# EAGLE schematic swimate_display (EAGLE 6.4)
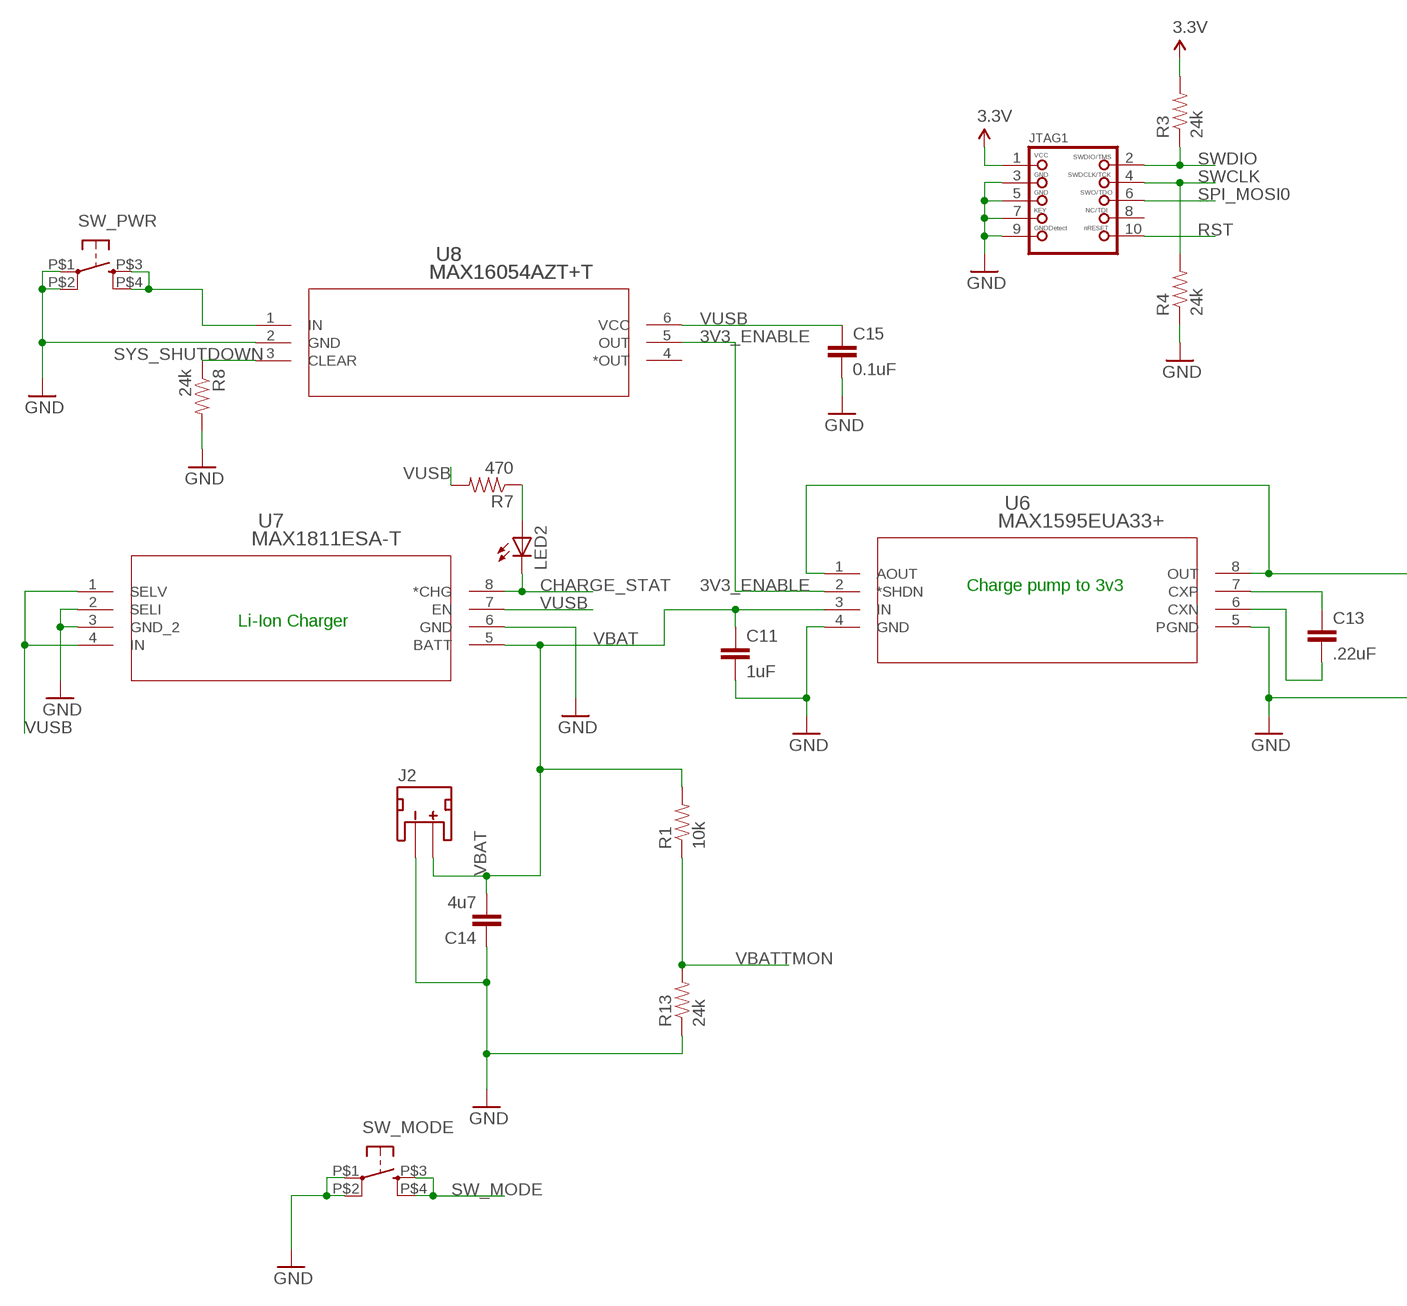
[diagram p0: schematic, sheet 1, part 1 of 2]
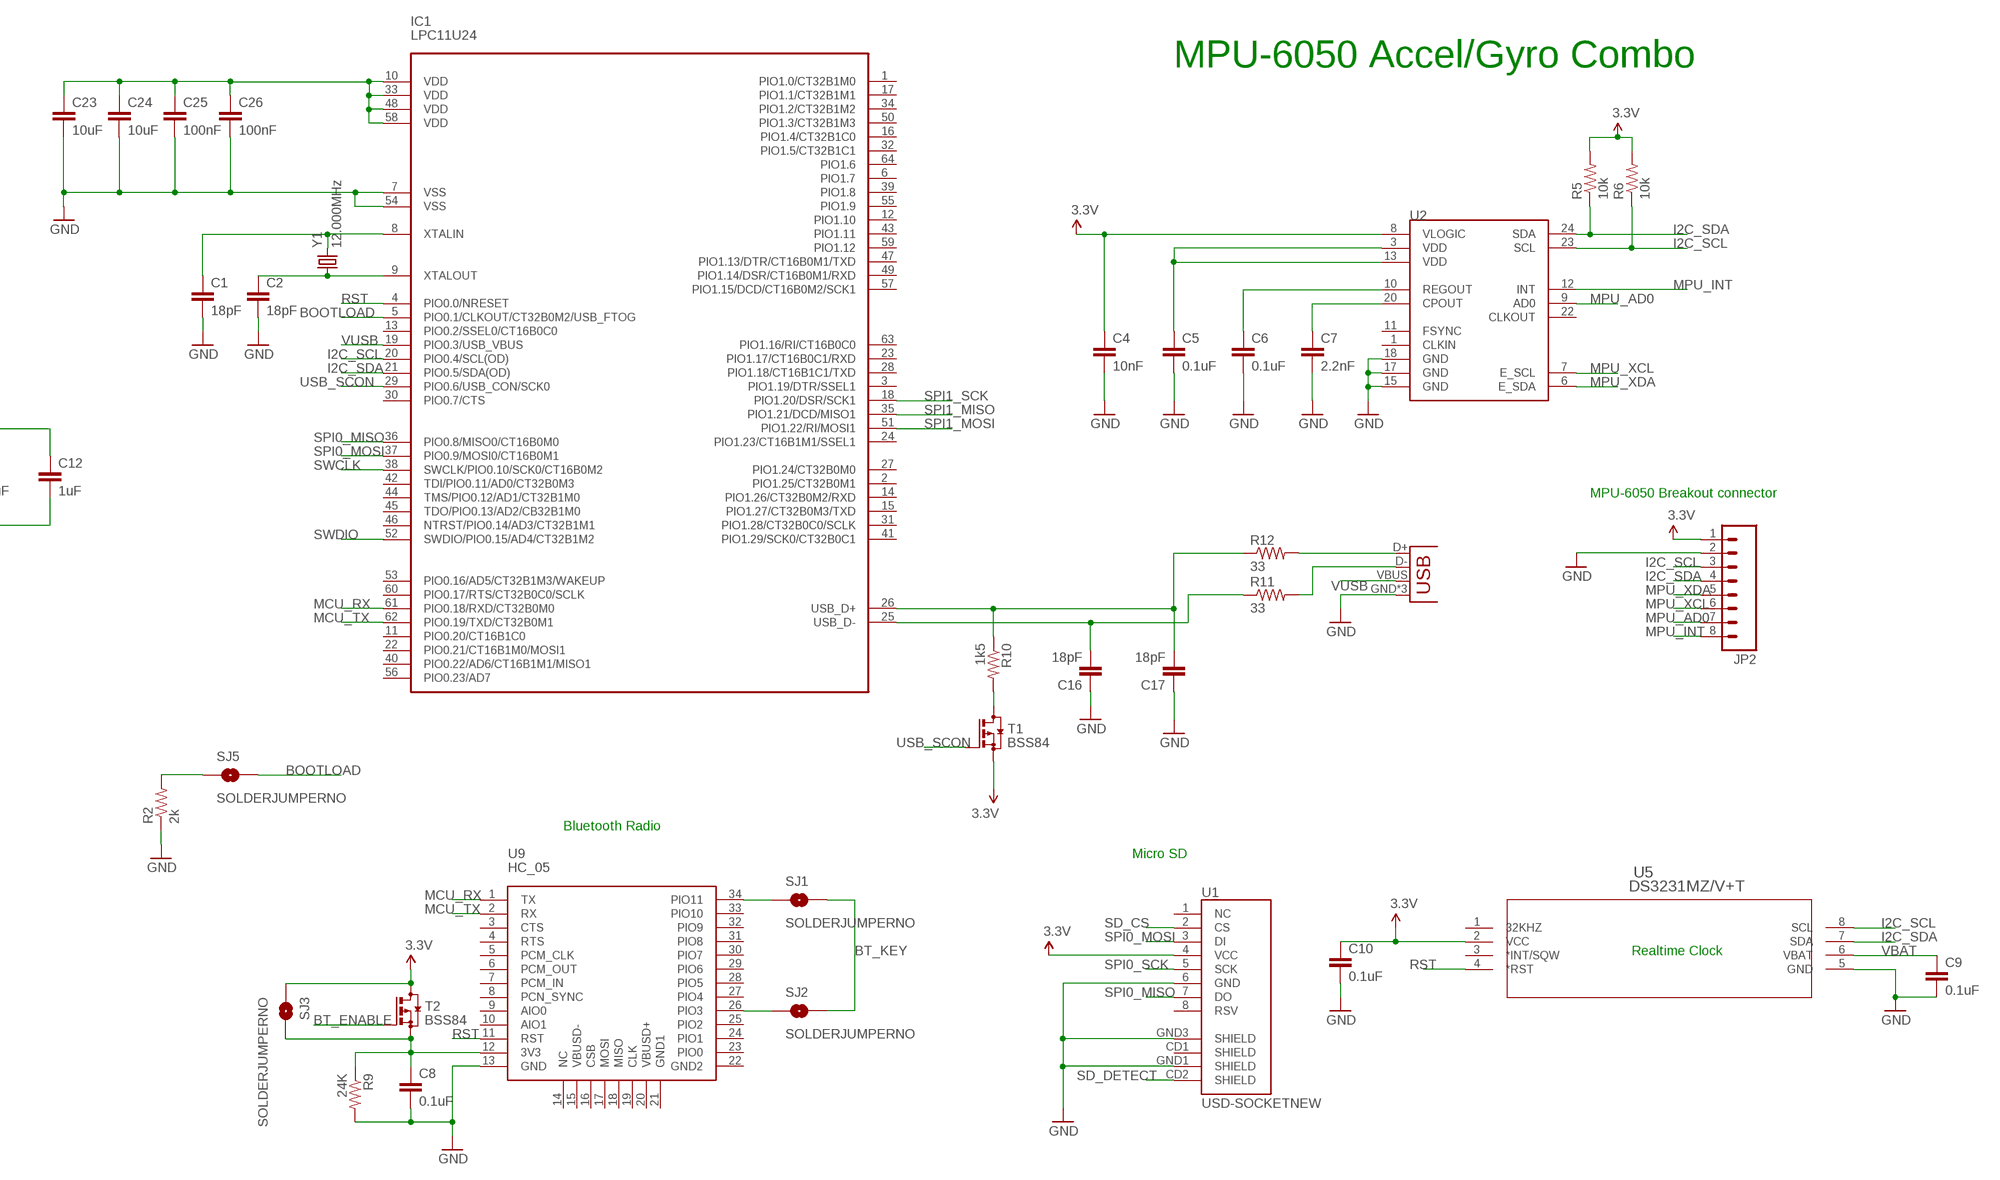
[diagram p1: schematic, sheet 1, part 2 of 2]

## Parts
C1  18pF  CAP0805  [0805]
C2  18pF  CAP0805  [0805]
C4  10nF  CAP0805  [0805]
C5  0.1uF  CAP0805  [0805]
C6  0.1uF  CAP0805  [0805]
C7  2.2nF  CAP0805  [0805]
C8  0.1uF  CAP0805  [0805]
C9  0.1uF  CAP0805  [0805]
C10  0.1uF  CAP0805  [0805]
C11  1uF  CAP1206  [1206]
C12  1uF  CAP1206  [1206]
C13  .22uF  CAP0805  [0805]
C14  4u7  CAP1206  [1206]
C15  0.1uF  CAP0805  [0805]
C16  18pF  CAP0805  [0805]
C17  18pF  CAP0805  [0805]
C23  10uF  CAP0805  [0805]
C24  10uF  CAP0805  [0805]
C25  100nF  CAP0805  [0805]
C26  100nF  CAP0805  [0805]
IC1  LPC11U24  [MBED-ICS_LQFP64]
J2  JST_2MM_MALE  [JST-2-SMD]
JP2  M08  [1X08_PIN1_NO_SILK]
JP3  USB-MICROB  [USB-MICROB]
JTAG1  JTAG-CORTEXM3  [2X05_1.27MM_SMT]
LED2  LED1206  [LED-1206]
R1  10k  RESISTOR0603-RES  [0603-RES]
R2  2k  RESISTOR0805-RES  [0805]
R3  24k  RESISTOR0805-RES  [0805]
R4  24k  RESISTOR0805-RES  [0805]
R5  10k  RESISTOR0805-RES  [0805]
R6  10k  RESISTOR0805-RES  [0805]
R7  470  RESISTOR0805-RES  [0805]
R8  24k  RESISTOR0805-RES  [0805]
R9  24K  RESISTOR0805-RES  [0805]
R10  1k5  RESISTOR0805-RES  [0805]
R11  33  RESISTOR0805-RES  [0805]
R12  33  RESISTOR0805-RES  [0805]
R13  24k  RESISTOR0603-RES  [0603-RES]
SJ1  SOLDERJUMPERNO  [SJ_2S-NO]
SJ2  SOLDERJUMPERNO  [SJ_2S-NO]
SJ3  SOLDERJUMPERNO  [SJ_2S-NO]
SJ5  SOLDERJUMPERNO  [SJ_2S-NO]
SW_MODE  TAC_SWITCHKSA_SEALED  [KSA_SEALED_TAC_SWITCH]
SW_PWR  TAC_SWITCHKSA_SEALED  [KSA_SEALED_TAC_SWITCH]
T1  BSS84  [SOT23]
T2  BSS84  [SOT23]
U1  USD-SOCKETNEW  [MICRO-SD-SOCKET-PP]
U2  MPU-9150QFN-24-NP  [QFN-24-NP]
U5  DS3231MZ/V+T  [21-0041B_8]
U6  MAX1595EUA33+  [21-0036K]
U7  MAX1811ESA-T  [21-0041B_8]
U8  MAX16054AZT+T  [21-0114C]
U9  HC_05  [BLUETOOTH_SMD]
Y1  12.000MHz  CRYSTAL10.5X4.8  [CRYSTAL-SMD-10.5X4.8-2PIN]

## Nets
3.3V: C4.1 C10.1 JP2.1 JTAG1.1 R3.2 R5.2 R6.2 SJ3.1 T1.2(S) T2.3(D) U1.4(VCC) U2.8(VLOGIC) U5.2(VCC)
3V3_ENABLE: U6.2(*SHDN) U8.5(OUT)
BOOTLOAD: IC1.5(PIO0.1/CLKOUT/CT32B0M2/USB_FTOG) SJ5.2
BT_ENABLE: T2.1(G)
BT_KEY: SJ1.2 SJ2.2
CHARGE_STAT: LED2.C U7.8(*CHG)
GND: C1.2 C2.2 C4.2 C5.2 C6.2 C7.2 C8.2 C9.2 C10.2 C11.2 C12.2 C14.1 C15.2 C16.1 C17.1 C23.2 C24.2 C25.2 C26.2 IC1.7(VSS) IC1.54(VSS) J2.1(-) JP2.2 JP3.GND JP3.MT1(GND) JP3.MT2(GND) JTAG1.3 JTAG1.5 JTAG1.7 JTAG1.9 R2.1 R4.1 R8.2 R9.2 R13.1 SW_MODE.P$1 SW_MODE.P$2 SW_PWR.P$1 SW_PWR.P$2 U1.6(GND) U1.GND1(SHIELD) U1.GND3(SHIELD) U2.15(GND) U2.17(GND) U2.18(GND) U5.5(GND) U6.4(GND) U6.5(PGND) U7.2(SELI) U7.3(GND_2) U7.6(GND) U8.2(GND) U9.13(GND)
I2C_SCL: IC1.20(PIO0.4/SCL(OD)) JP2.3 R6.1 U2.23(SCL) U5.8(SCL)
I2C_SDA: IC1.21(PIO0.5/SDA(OD)) JP2.4 R5.1 U2.24(SDA) U5.7(SDA)
MCU_RX: IC1.61(PIO0.18/RXD/CT32B0M0) U9.1(TX)
MCU_TX: IC1.62(PIO0.19/TXD/CT32B0M1) U9.2(RX)
MPU_AD0: JP2.7 U2.9(AD0)
MPU_INT: JP2.8 U2.12(INT)
MPU_XCL: JP2.6 U2.7(E_SCL)
MPU_XDA: JP2.5 U2.6(E_SDA)
N$1: SW_PWR.P$3 SW_PWR.P$4 U8.1(IN)
N$4: C5.1 U2.3(VDD) U2.13(VDD)
N$5: C6.1 U2.10(REGOUT)
N$6: C23.1 C24.1 C25.1 C26.1 IC1.10(VDD) IC1.33(VDD) IC1.48(VDD) IC1.58(VDD)
N$7: C7.1 U2.20(CPOUT)
N$8: LED2.A R7.1
N$9: SJ2.1 U9.26(PIO3)
N$11: SJ1.1 U9.34(PIO11)
N$12: C12.1 U6.1(AOUT) U6.8(OUT)
N$13: C13.1 U6.7(CXP)
N$14: C13.2 U6.6(CXN)
N$15: C8.1 R9.1 SJ3.2 T2.2(S) U9.12(3V3)
N$16: R10.2 T1.3(D)
N$17: C17.2 IC1.26(USB_D+) R10.1 R12.1
N$18: C16.2 IC1.25(USB_D-) R11.1
N$19: JP3.D+ R12.2
N$20: JP3.D- R11.2
N$21: R2.2 SJ5.1
N$23: C1.1 IC1.8(XTALIN) Y1.P$2
N$24: C2.1 IC1.9(XTALOUT) Y1.P$1
RST: IC1.4(PIO0.0/NRESET) JTAG1.10 U5.4(*RST) U9.11(RST)
SD_CS: U1.2(CS)
SD_DETECT: U1.CD2(SHIELD)
SPI0_MISO: IC1.36(PIO0.8/MISO0/CT16B0M0) U1.7(DO)
SPI0_MOSI: IC1.37(PIO0.9/MOSI0/CT16B0M1) U1.3(DI)
SPI0_SCK: U1.5(SCK)
SPI1_MISO: IC1.35(PIO1.21/DCD/MISO1)
SPI1_MOSI: IC1.51(PIO1.22/RI/MOSI1)
SPI1_SCK: IC1.18(PIO1.20/DSR/SCK1)
SPI_MOSI0: JTAG1.6
SW_MODE: SW_MODE.P$3 SW_MODE.P$4
SWCLK: IC1.38(SWCLK/PIO0.10/SCK0/CT16B0M2) JTAG1.4 R4.2
SWDIO: IC1.52(SWDIO/PIO0.15/AD4/CT32B1M2) JTAG1.2 R3.1
SYS_SHUTDOWN: R8.1 U8.3(CLEAR)
USB_SCON: IC1.29(PIO0.6/USB_CON/SCK0) T1.1(G)
VBAT: C9.1 C11.1 C14.2 J2.2(+) R1.2 U5.6(VBAT) U6.3(IN) U7.5(BATT)
VBATTMON: R1.1 R13.2
VUSB: C15.1 IC1.19(PIO0.3/USB_VBUS) JP3.VBUS R7.2 U7.1(SELV) U7.4(IN) U7.7(EN) U8.6(VCC)
Unconnected: IC1.1(PIO1.0/CT32B1M0) IC1.2(PIO1.25/CT32B0M1) IC1.3(PIO1.19/DTR/SSEL1) IC1.6(PIO1.7) IC1.11(PIO0.20/CT16B1C0) IC1.12(PIO1.10) IC1.13(PIO0.2/SSEL0/CT16B0C0) IC1.14(PIO1.26/CT32B0M2/RXD) IC1.15(PIO1.27/CT32B0M3/TXD) IC1.16(PIO1.4/CT32B1C0) IC1.17(PIO1.1/CT32B1M1) IC1.22(PIO0.21/CT16B1M0/MOSI1) IC1.23(PIO1.17/CT16B0C1/RXD) IC1.24(PIO1.23/CT16B1M1/SSEL1) IC1.27(PIO1.24/CT32B0M0) IC1.28(PIO1.18/CT16B1C1/TXD) IC1.30(PIO0.7/CTS) IC1.31(PIO1.28/CT32B0C0/SCLK) IC1.32(PIO1.5/CT32B1C1) IC1.34(PIO1.2/CT32B1M2) IC1.39(PIO1.8) IC1.40(PIO0.22/AD6/CT16B1M1/MISO1) IC1.41(PIO1.29/SCK0/CT32B0C1) IC1.42(TDI/PIO0.11/AD0/CT32B0M3) IC1.43(PIO1.11) IC1.44(TMS/PIO0.12/AD1/CT32B1M0) IC1.45(TDO/PIO0.13/AD2/CB32B1M0) IC1.46(NTRST/PIO0.14/AD3/CT32B1M1) IC1.47(PIO1.13/DTR/CT16B0M1/TXD) IC1.49(PIO1.14/DSR/CT16B0M1/RXD) IC1.50(PIO1.3/CT32B1M3) IC1.53(PIO0.16/AD5/CT32B1M3/WAKEUP) IC1.55(PIO1.9) IC1.56(PIO0.23/AD7) IC1.57(PIO1.15/DCD/CT16B0M2/SCK1) IC1.59(PIO1.12) IC1.60(PIO0.17/RTS/CT32B0C0/SCLK) IC1.63(PIO1.16/RI/CT16B0C0) IC1.64(PIO1.6) J2.NC1(PAD1) J2.NC2(PAD2) JTAG1.8 U1.1(NC) U1.8(RSV) U1.CD1(SHIELD) U2.1(CLKIN) U2.11(FSYNC) U2.22(CLKOUT) U5.1(32KHZ) U5.3(*INT/SQW) U8.4(*OUT) U9.3(CTS) U9.4(RTS) U9.5(PCM_CLK) U9.6(PCM_OUT) U9.7(PCM_IN) U9.8(PCN_SYNC) U9.9(AIO0) U9.10(AIO1) U9.14(NC) U9.15(VBUSD-) U9.16(CSB) U9.17(MOSI) U9.18(MISO) U9.19(CLK) U9.20(VBUSD+) U9.21(GND1) U9.22(GND2) U9.23(PIO0) U9.24(PIO1) U9.25(PIO2) U9.27(PIO4) U9.28(PIO5) U9.29(PIO6) U9.30(PIO7) U9.31(PIO8) U9.32(PIO9) U9.33(PIO10)

## Notes on the sheet
- MPU-6050 Accel/Gyro Combo
- Charge pump to 3v3
- Li-Ion Charger
- MPU-6050 Breakout connector
- Bluetooth Radio
- Micro SD
- Realtime Clock

## Library data of the parts
C1 C2 C4-C10 C13-C17 = SparkFun-Passives:CAP: Capacitor Standard 0603 ceramic capacitor, and 0.1" leaded capacitor.
C11 C12 C23-C26 = SparkFun-Capacitors:CAP: Capacitor Standard 0603 ceramic capacitor, and 0.1" leaded capacitor.
IC1 = mbed-HDK:LPC11U24: NXP Cortex-M0 Micrcontroller
J2 = SparkFun-Connectors:JST_2MM_MALE: Mates to single-cell LiPo batteries. CONN-08352; PROD_ID: CONN-08352
JP2 = SparkFun-Connectors:M08: Header 8 Standard 8-pin 0.1" header. Use with straight break away headers (SKU : PRT-00116), right angle break away headers (PRT-00553), swiss pins (PRT-00743), machine pins (PRT-00117), and female headers (PRT-00115).
JP3 = SparkFun-Connectors:USB: USB Connectors USB-B-PTH is fully proven SKU : PRT-00139/CONN-08278 USB-miniB is fully proven SKU : PRT-00587 USB-A-PCB is untested. USB-A-H is throughly reviewed, but untested. Spark Fun Electronics SKU : PRT-00437 USB-B-SMT is throughly reviewed, but untested. Needs silkscreen touching up. USB-A-S has not been used/tested USB-MB-H has not been used/tested USB-MICROB has been used. CONN-09505; PROD_ID: CONN-09505
JTAG1 = microbuilder:JTAG-CORTEXM3: Serial Wire (SW-DP) Connector This standard 0.05" 10-pin connector is for use with the Cortex M0/M3's native SWD (serial wire debugger) interface (SW-DP). Some boards support a 20-pin combined JTAG+SWD connector (SWJ-DP), such as the LPC1700 family, but many smaller devices only work with SWD which typically use the smaller 10-pin SW-DP connecter (the LPC1300 family, for example, only supports SWD). 2x05 1.27mm/0.05" Connector: This is the standard SMT connector defined by ARM for all Cortex devices, and should be used in most situations and for forward-compatibility since any new devices coming to market will likely use this connector. MOLEX 10 Pin 0.1" Connector: This 0.1" 10 pin connector has the same pin layout as the standard 0.05" connector, but is easier to work with if you are using standard jumper wires or custom cables to connect your SWD hardware. MOLEX 20 Pin 0.1" Connector: This 0.1" 20 pin connector is the same model used for ARM7/ARM9 JTAG debuggers, but is connected to match the pins on the Segger J-Link for ARM (which supports both JTAG and SWD debugging). See the following document from ARM for more information on Cortex M3 Debug Connectors: http://infocenter.arm.com/help/topic/com.arm.doc.faqs/attached/13634/cortex_debug_connectors.pdf And the following page for an overview with images of the different connector types: http://www.keil.com/peripherals/coresight/connectors.asp
LED2 = SparkFun-LED:LED: LEDs Standard schematic elements and footprints for 5mm, 3mm, 1206, and 0603 sized LEDs. 5mm - Spark Fun Electronics SKU : COM-00529 (and others)
R1-R13 = SparkFun-Passives:RESISTOR: Resistor Basic schematic elements and footprints for 0603, 1206, and PTH resistors.
SJ1-SJ3 SJ5 = SparkFun-Passives:SOLDERJUMPER: Solder Jumper Standard SMD solder jumper. Used to automate production. Two varients : Normally Open and Normally Closed are the same, but have different paste layers. NC will have a large amount of paste and should jumper during reflow.
SW_MODE SW_PWR = SparkFun-Electromechanical:TAC_SWITCH: Momentary Switch Button commonly used for reset or general input. Spark Fun Electronics SKU : COM-00097 SMT- SWCH-08247
T1 T2 = mbed-HDK:BSS84: P-CHANNEL MOS FET
U1 = SparkFun-Connectors:USD-SOCKET: microSD Socket Push-push type uSD socket. Schematic element and footprint production proven. Spark Fun Electronics SKU : PRT-00127. tDoc lines correctly indicate media card edge positions when inserting (unlocked, locked, depressed).
U2 = SparkFun-Sensors:MPU-9150: 9DOF (3mag, 3accel, 3rotat). I2C interface.
U5 = maximparts:DS3231MZ/V+T; MANUFACTURER_NAME: Maxim; MANUFACTURER_PART_NUMBER: DS3231MZ/V+T; VENDOR: Maxim
U6 = maximparts:MAX1595EUA33+; MANUFACTURER_NAME: Maxim; MANUFACTURER_PART_NUMBER: MAX1595EUA33+; VENDOR: Maxim
U7 = maximparts:MAX1811ESA-T; MANUFACTURER_NAME: Maxim; MANUFACTURER_PART_NUMBER: MAX1811ESA-T; VENDOR: Maxim
U8 = maximparts:MAX16054AZT+T; MANUFACTURER_NAME: Maxim; MANUFACTURER_PART_NUMBER: MAX16054AZT+T; VENDOR: Maxim
U9 = Bluetooth HC-05:HC_05: HC-05 Bluetooth Module
Y1 = SparkFun-FreqCtrl:CRYSTAL: Various standard crystals. Proven footprints. Spark Fun Electronics SKU : COM-00534